# Altium schematic sheet Power.SchDoc
size A3; SheetNumber: 3; SheetTotal: 4
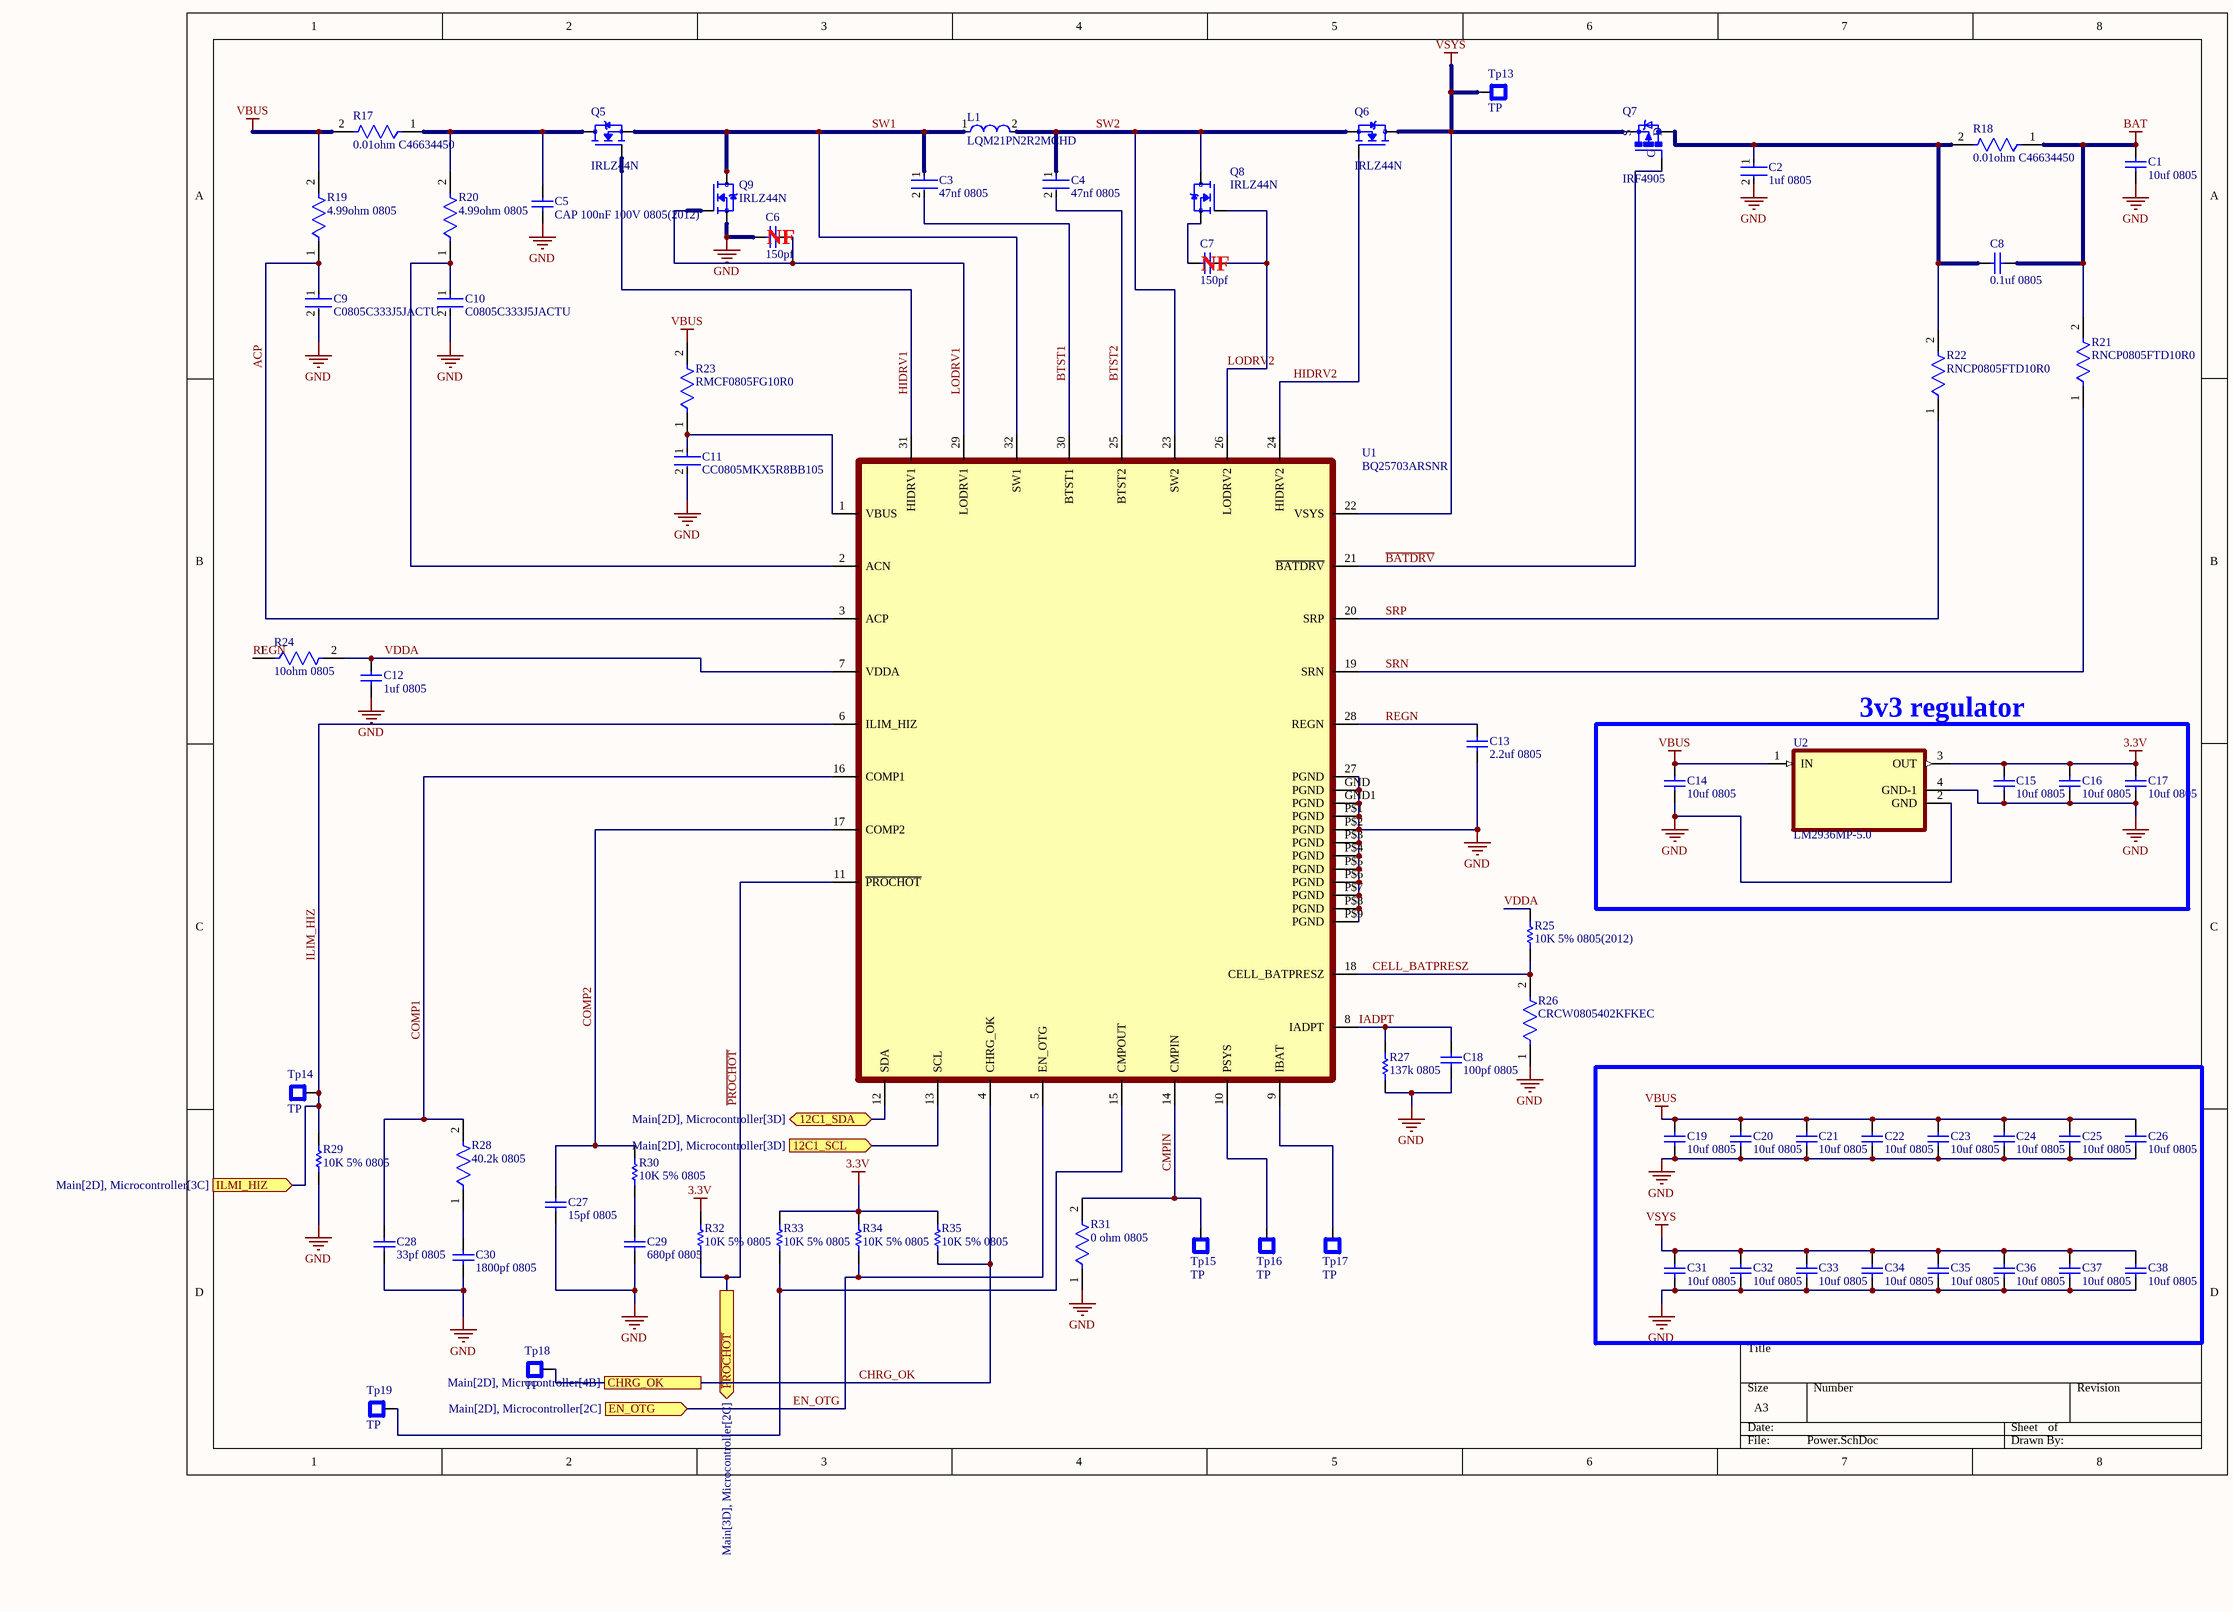
[diagram p0: Power.SchDoc]

## Parts
C1  10uf 0805  [CAPC2013X140X50ML20T25]
C2  1uf 0805  [FP-0805-L_2_01_0_2-W_1_25-MFG]
C3  47nf 0805  [FP-C0805C-DN-MFG]
C4  47nf 0805  [FP-C0805C-DN-MFG]
C5  CAP 100nF 100V 0805(2012)  [CAPC0805(2012)145_M]
C6  150pf  [CAPC2013X145X48NL20T23]
C7  150pf  [CAPC2013X145X48NL20T23]
C8  0.1uf 0805  [CAPC2013X140X50ML20T25]
C9  C0805C333J5JACTU  [FP-C0805C-DN-MFG]
C10  C0805C333J5JACTU  [FP-C0805C-DN-MFG]
C11  CC0805MKX5R8BB105  [FP-CC0805-0_85-MFG]
C12  1uf 0805  [CAPC2013X145X50NL20T20]
C13  2.2uf 0805  [CAPC2013X100X50ML20T25]
C14  10uf 0805  [CAPC2013X140X50ML20T25]
C15  10uf 0805  [CAPC2013X140X50ML20T25]
C16  10uf 0805  [CAPC2013X140X50ML20T25]
C17  10uf 0805  [CAPC2013X140X50ML20T25]
C18  100pf 0805  [CAPC2013X127X50NL20T25]
C19  10uf 0805  [CAPC2013X140X50ML20T25]
C20  10uf 0805  [CAPC2013X140X50ML20T25]
C21  10uf 0805  [CAPC2013X140X50ML20T25]
C22  10uf 0805  [CAPC2013X140X50ML20T25]
C23  10uf 0805  [CAPC2013X140X50ML20T25]
C24  10uf 0805  [CAPC2013X140X50ML20T25]
C25  10uf 0805  [CAPC2013X140X50ML20T25]
C26  10uf 0805  [CAPC2013X140X50ML20T25]
C27  15pf 0805  [CAPC2013X94X50LL20T25]
C28  33pf 0805  [CAPC2013X145X48LL20T23]
C29  680pf 0805  [CAPC0805(2012)145_L]
C30  1800pf 0805  [CAPC2013X145X48ML20T23]
C31  10uf 0805  [CAPC2013X140X50ML20T25]
C32  10uf 0805  [CAPC2013X140X50ML20T25]
C33  10uf 0805  [CAPC2013X140X50ML20T25]
C34  10uf 0805  [CAPC2013X140X50ML20T25]
C35  10uf 0805  [CAPC2013X140X50ML20T25]
C36  10uf 0805  [CAPC2013X140X50ML20T25]
C37  10uf 0805  [CAPC2013X140X50ML20T25]
C38  10uf 0805  [CAPC2013X140X50ML20T25]
L1  LQM21PN2R2MCHD  [FP-LQM21PN_CH-IPC_C]
Q5  IRLZ44N  [TO254P1054X469X1930-3]
Q6  IRLZ44N  [TO254P1054X469X1930-3]
Q7  IRF4905  [TO220BH]
Q8  IRLZ44N  [TO254P1054X469X1930-3]
Q9  IRLZ44N  [TO254P1054X469X1930-3]
R17  0.01ohm C46634450  [FP-CRCW0805-HPe3-MFG]
R18  0.01ohm C46634450  [FP-CRCW0805-HPe3-MFG]
R19  4.99ohm 0805  [FP-CRCW0805-HPe3-MFG]
R20  4.99ohm 0805  [FP-CRCW0805-HPe3-MFG]
R21  RNCP0805FTD10R0  [FP-RNCP0805-IPC_C]
R22  RNCP0805FTD10R0  [FP-RNCP0805-IPC_C]
R23  RMCF0805FG10R0  [FP-RMCF0805-IPC_B]
R24  10ohm 0805  [FP-RMCF0805-IPC_B]
R25  10K 5% 0805(2012)  [RESC0805(2012)_L]
R26  CRCW0805402KFKEC  [FP-CRCW0805-e3-IPC_B]
R27  137k 0805  [RESC2013X60X35ML10T20]
R28  40.2k 0805  [FP-ESR10-MFG]
R29  10K 5% 0805  [RESC0805(2012)_L]
R30  10K 5% 0805  [RESC0805(2012)_L]
R31  0 ohm 0805  [FP-HCJ0805-MFG]
R32  10K 5% 0805  [RESC0805(2012)_L]
R33  10K 5% 0805  [RESC0805(2012)_L]
R34  10K 5% 0805  [RESC0805(2012)_L]
R35  10K 5% 0805  [RESC0805(2012)_L]
Tp13  TP  [Tp]
Tp14  TP  [Tp]
Tp15  TP  [Tp]
Tp16  TP  [Tp]
Tp17  TP  [Tp]
Tp18  TP  [Tp]
Tp19  TP  [Tp]
U1  BQ25703ARSNR  [BQ25703A_QFN-32]
U2  LM2936MP-5.0  [SOT230P700X180-4N]

## Blocks framed on the sheet
3v3 regulator: C14-C17 U2

## Ports
12C1_SCL (in, see Main[2D], Microcontroller[3D]), 12C1_SDA (bidir, see Main[2D], Microcontroller[3D]), CHRG_OK (see Main[2D], Microcontroller[4B]), EN_OTG (in, see Main[2D], Microcontroller[2C]), ILMI_HIZ (in, see Main[2D], Microcontroller[3C]), ~{PROCHOT} (out, see Main[3D], Microcontroller[2C])

## Nets
3.3V: C15.2 C16.2 C17.2 R32.2 R33.2 R34.2 R35.2 U2.3(OUT)
BAT: C1.2 C8.1 R18.1 R21.2
GND: C1.1 C2.2 C5.1 C6.1 C9.2 C10.2 C11.2 C12.1 C13.1 C14.1 C15.1 C16.1 C17.1 C18.1 C19.1 C20.1 C21.1 C22.1 C23.1 C24.1 C25.1 C26.1 C27.1 C28.1 C29.1 C30.1 C31.1 C32.1 C33.1 C34.1 C35.1 C36.1 C37.1 C38.1 Q9.3(S) R26.1 R27.1 R29.1 R31.1 U1.27(PGND) U1.GND(PGND) U1.GND1(PGND) U1.P$1(PGND) U1.P$2(PGND) U1.P$3(PGND) U1.P$4(PGND) U1.P$5(PGND) U1.P$6(PGND) U1.P$7(PGND) U1.P$8(PGND) U1.P$9(PGND) U2.2(GND) U2.4(GND-1)
VBUS: C14.2 C19.2 C20.2 C21.2 C22.2 C23.2 C24.2 C25.2 C26.2 R17.2 R19.2 R23.2 U2.1(IN)
VSYS: C31.2 C32.2 C33.2 C34.2 C35.2 C36.2 C37.2 C38.2 Q6.2(D) Q7.S Tp13.1 U1.22(VSYS)
12C1_SCL: U1.13(SCL) ; port 12C1_SCL
12C1_SDA: U1.12(SDA) ; port 12C1_SDA
~{BATDRV}: Q7.G U1.21(~{BATDRV})
~{PROCHOT}: R32.1 U1.11(~{PROCHOT}) ; port ~{PROCHOT}
ACP: C9.1 R19.1 U1.3(ACP)
BTST1: C3.2 U1.30(BTST1)
BTST2: C4.2 U1.25(BTST2)
CELL_BATPRESZ: R25.1 R26.2 U1.18(CELL_BATPRESZ)
CHRG_OK: R35.1 Tp18.1 U1.4(CHRG_OK) ; port CHRG_OK
CMPIN: R31.2 Tp15.1 U1.14(CMPIN)
COMP1: C28.2 R28.2 U1.16(COMP1)
COMP2: C27.2 R30.2 U1.17(COMP2)
EN_OTG: R34.1 U1.5(EN_OTG) ; port EN_OTG
HIDRV1: Q5.1(G) U1.31(HIDRV1)
HIDRV2: Q6.1(G) U1.24(HIDRV2)
IADPT: C18.2 R27.2 U1.8(IADPT)
ILIM_HIZ: R29.2 Tp14.1 U1.6(ILIM_HIZ) ; port ILMI_HIZ
LODRV1: C6.2 Q9.1(G) U1.29(LODRV1)
LODRV2: C7.1 Q8.1(G) U1.26(LODRV2)
REGN: C13.2 R24.1 U1.28(REGN)
SRN: R21.1 U1.19(SRN)
SRP: R22.1 U1.20(SRP)
SW1: C3.1 L1.1 Q5.3(S) Q9.2(D) U1.32(SW1)
SW2: C4.1 L1.2 Q6.3(S) Q8.2(D) U1.23(SW2)
VDDA: C12.2 R24.2 R25.2 U1.7(VDDA)
NetC2_1: C2.1 C8.2 Q7.D R18.2 R22.2
NetC5_2: C5.2 Q5.2(D) R17.1 R20.2
NetC7_2: C7.2 Q8.3(S)
NetC10_1: C10.1 R20.1 U1.2(ACN)
NetC11_1: C11.1 R23.1 U1.1(VBUS)
NetC29_2: C29.2 R30.1
NetC30_2: C30.2 R28.1
NetR33_1: R33.1 Tp19.1 U1.15(CMPOUT)
NetTp16_1: Tp16.1 U1.10(PSYS)
NetTp17_1: Tp17.1 U1.9(IBAT)

## Notes on the sheet
- (near C6) NF
- (near C7) NF

## Library data of the parts
C1 C14-C17 C19-C26 C31-C38 = CMP-2007-04702-1: Manufacturer: AVX Interconnect / Elco; Part Number: 0805ZC106KAT2A
C2 = CMP-07738-122049624-1: 08051C105K4T2A Cap Ceramic 1uF 100V X7R 10% Pad SMD 0805 125C Automotive T/R; Capacitance: 1µF; Tolerance: 10%; Dielectric: X7R; Case/Package: 0805; Material: Ceramic; Height: 1.4mm; Voltage Rating (DC): 100V; Voltage Rating: 100V; Schedule B: 8532240020; NexarPartId: 122049624; RoHS: Compliant; Lifecycle Status: Production; Min Operating Temperature: -55°C; Max Operating Temperature: 125°C
C3 C4 = CMP-2007-00394-2: CAP CER 0.047UF 50V X7R 0805; Manufacturer: KEMET; Manufacturer Part Number: C0805C473K5RACAUTO; Value: 47,000 pF; Tolerance: 0.1; Temperature Coefficient: 30ppm/°C; Material: Ceramic; Temperature: -55°C to +125°C; ComponentLink2Description: Datasheet; Ipc Land Pattern Name: CAPC200125X78; Automotive: No; Voltage Rating: 50 V; Package: C0805C-DN; Category: Cap; Temperature Range High: +125°C; Device Class L2: Capacitors; Lead Free: Yes; Height: 0.88mm; Temperature Range Low: -55°C; Digikey Description: CAP CER 0.047UF 50V X7R 0805; ComponentLink2URL: https://content.kemet.com/datasheets/KEM_C1003_C0G_SMD.pdf; Device Class L1: Passive Components; Octopart: https://octopart.com/c0805c473k5racauto-kemet-12580596; Device Class L3: Ceramic Capacitors; RoHS: TRUE; Temperature Characteristic: X7R; Mouser Description: Multilayer Ceramic Capacitors MLCC - SMD/SMT 0.047uF 50volts 10% X7R AUTO; Capacitance: 47,000 pF
C5 = CMP-1036-04429-1: CAP 100nF 100V ±10% 0805 (2012 Metric) Thickness 1.45mm SMD; Tolerance: Â±10%; Case-Metric: 2012; Case-EIA: 0805; Rated Voltage: 100 V; Max Thickness: 1.45 mm; Technology: SMT; Value: 100nF
C6 C7 = CMP-2007-01759-1: Part Number: VJ0805A151JXAMC; Manufacturer: Vitramon
C8 = CMP-2007-04651-1: Part Number: 0805DD104KAT2A; Manufacturer: AVX Interconnect / Elco
C9 C10 = CMP-03020-013264-1: CAP CER 0.033UF 50V U2J 0805; Manufacturer: KEMET; Material: Ceramic; Value: 33,000 pF; Temperature Coefficient: 30ppm/°C; Tolerance: 0.05; Temperature Range Low: -55°C; Automotive: No; Device Class L3: Ceramic Capacitors; Device Class L2: Capacitors; RoHS: TRUE; Octopart: https://octopart.com/c0805c333j5jactu-kemet-74774612; Device Class L1: Passive Components; Manufacturer Part Number: C0805C333J5JACTU; ComponentLink2URL: https://content.kemet.com/datasheets/KEM_C1003_C0G_SMD.pdf; Temperature Characteristic: U2J; Ipc Land Pattern Name: CAPC200125X78; Height: 0.88mm; Category: Cap; ComponentLink2Description: Datasheet; Temperature: -55°C to +125°C; Capacitance: 33,000 pF; Package: C0805C-DN; Temperature Range High: +125°C; Voltage Rating: 50 V; Lead Free: Yes; Digikey Description: CAP CER 0.033UF 50V U2J 0805
C11 = CMP-03422-000762-1: CAP CER 1UF 25V X5R 0805; Manufacturer: Yageo; Material: Ceramic; Tolerance: 0.2; Package: CC0805-0.85; Value: 1 uF; Digikey Description: CAP CER 1UF 25V X5R 0805; ComponentLink2URL: http://www.yageo.com/documents/recent/UPY-GPHC_Y5V_6.3V-to-50V_8.pdf; Temperature: -30°C to +85°C; Device Class L1: Passive Components; Lead Free: Yes; Automotive: No; Ipc Land Pattern Name: CAPC200125X85; Footprint Url: http://www.yageo.com/exep/pages/download/literatures/UPY-C_GEN_24.pdf; Device Class L3: Ceramic Capacitors; RoHS: TRUE; Temperature Range High: +85°C; Capacitance: 1 uF; Height: 0.95mm; Mouser Description: Cap Cer 1uf 25v X5r 0805; Temperature Range Low: -30°C; Octopart: https://octopart.com/cc0805mkx5r8bb105-yageo-81932645; Voltage Rating: 25 V; ComponentLink2Description: Datasheet; Device Class L2: Capacitors; Temperature Characteristic: X5R; Manufacturer Part Number: CC0805MKX5R8BB105; Category: Cap
C12 = CMP-2007-01676-1: Part Number: VJ0805Y105KXQRW1BC; Manufacturer: Vitramon
C13 = CMP-2007-03688-1: Part Number: C0805C225M4PACTU; Manufacturer: Kemet
C18 = CMP-2007-04832-1: Part Number: 08052C101KAT2A; Manufacturer: AVX Interconnect / Elco
C27 = CMP-2007-04132-1: Part Number: 08051A150KAT2A; Manufacturer: AVX Interconnect / Elco
C28 = CMP-2007-01784-1: Part Number: VJ0805A330JXBAC; Manufacturer: Vitramon
C29 = CMP-1036-02840-1: CAP 680pF 100V ±10% 0805 (2012 Metric) Thickness 1.45mm SMD; Tolerance: Â±10%; Case-Metric: 2012; Case-EIA: 0805; Max Thickness: 1.45 mm; Technology: SMT; Value: 680pF; Rated Voltage: 100 V
C30 = CMP-2007-01890-1: Part Number: VJ0805A182FXAMT; Manufacturer: Vitramon
L1 = CMP-06042-016495-1: Multilayer Type Inductor for Power Lines, 2012, 2.2μH, 20%, 0.25Ω, 1.3A; RoHS Compliant: Yes
Q5 Q6 Q8 Q9 = IRLZ44N: N-Channel 55 V 47A (Tc) 3.8W (Ta), 110W (Tc) Surface Mount D2PAK; MF: Infineon / IR; Package: TO-220-3 Infineon / IR; Availability: Not in stock; Value: *; MP: IRLZ44N; Check_prices: https://www.snapeda.com/parts/IRLZ44N/Infineon/view-part/?ref=eda; Price: None; SnapEDA_Link: https://www.snapeda.com/parts/IRLZ44N/Infineon/view-part/?ref=snap
Q7 = IRF4905: P-Channel 55 V 74A (Tc) 200W (Tc) Through Hole TO-220AB; MF: Infineon / IR; SnapEDA_Link: https://www.snapeda.com/parts/IRF4905/Infineon/view-part/?ref=snap; Package: TO-263-3 Infineon / IR; Value: *; MP: IRF4905; Check_prices: https://www.snapeda.com/parts/IRF4905/Infineon/view-part/?ref=eda
R17-R20 = CMP-02407-002418-1: RES Thick Film, 4.99Ω, 0.5%, 0.5W, 100ppm/°C, 0805
R21 R22 = CMP-26527-001729-1: 10Ω ±1% 0.25W 0805 High Power Anti-Sulfur Thin Film Chip Resistor; Temperature Coefficient: 100ppm/°C; Max Power Dissipation: 250mW; Resistance: 10R; Length: 0.079inch; Tolerance: 1%; Series: RNCP; Case Code (Metric): 2012; Packaging: Tape and Reel; Resistor Type: Thin Film; Mount: Surface Mount; Min Operating Temperature: -55°C; Case Code (Imperial): 0805; Height: 0.024inch; Features: Moisture Resistant; RoHS Compliant: Yes; Width: 0.049inch; Max Operating Temperature: 155°C; Case/Package: 0805; Number of Terminations: 2
R23 R24 = CMP-26527-004108-1: 10Ω ±1% 0.125W 0805 Thick Film Chip Resistor AEC-Q200 compliant; Max Power Dissipation: 125mW; Resistance: 10R; Temperature Coefficient: 100ppm/°C; Series: RMCF; Resistor Type: Thick Film; Width: 0.049inch; Contact Plating: Tin; Number of Terminations: 2; Radiation Hardening: No; Max Operating Temperature: 155°C; Length: 0.079inch; RoHS Compliant: Yes; Mount: Surface Mount; Tolerance: 1%; Case/Package: 0805; Packaging: Tape and Reel; Min Operating Temperature: -55°C; Height: 0.026inch; Features: Automotive AEC-Q200
R25 R29 R30 R32-R35 = CMP-1013-00098-1: 10K 0.125W 5% 0805 (2012 Metric)  SMD; Case-EIA: 0805; Case-Metric: 2012; Value: 10000.00 Ohm; Power: 0.125 W; Technology: SMT; Tolerance: 5 %
R26 = CMP-02407-010674-1: RES Thick Film, 402kΩ, 1%, 0.125W, 100ppm/°C, 0805; Resistance: 402kR; Max Power Dissipation: 125mW; Temperature Coefficient: 100ppm/°C; Composition: Thick Film; Height: 0.02inch; Length: 0.079inch; Package Quantity: 20000; Tolerance: 1%; Max Operating Temperature: 155°C; Lead Free: Lead Free; Min Operating Temperature: -55°C; Number of Terminations: 2; Case/Package: 0805; Packaging: Tape and Reel; Width: 0.049inch; Features: Automotive AEC-Q200
R27 = CMP-2001-00916-1: Manufacturer: Yageo; Part Number: RC0805FR-07137KL
R28 = CMP-08839-028060-1: 40.2kΩ ±1% 0.4W 0805 Anti-Surge Chip Resistor AEC-Q200; Max Power Dissipation: 400mW; Resistance: 40.2kR; Temperature Coefficient: 100ppm/°C; Length: 0.079inch; Width: 0.049inch; Package Quantity: 5000; Min Operating Temperature: -55°C; Case/Package: 0805; Features: Automotive AEC-Q200; Series: ESR10; Height: 0.026inch; Packaging: Tape and Reel; Max Operating Temperature: 155°C; Tolerance: 1%; RoHS Compliant: Yes; Number of Terminations: 2; Resistor Type: Thick Film
R31 = CMP-26527-000104-1: RES 0 OHM JUMPER 1/2W 0805; Resistance: 0mR; Radiation Hardening: No; Case Code (Imperial): 0805; Number of Terminations: 2; Lead Free: Lead Free; Max Operating Temperature: 155°C; Width: 0.049inch; Case Code (Metric): 2012; Height: 0.026inch; Mount: Surface Mount; Min Operating Temperature: -55°C; Packaging: Tape and Reel; Package Quantity: 1; Termination: Wraparound; Length: 0.079inch; RoHS Compliant: Yes; Case/Package: 0805
U1 = BQ25703ARSNR: MCU 32-bit ARM Cortex M0+ RISC 128KB Flash 1.8V/2.5V/3.3V 48-Pin LQFP Tray; Manufacturer: STMicroelectronics; Manufacturer Part Number: STM32G071CBT6; MF: Texas Instruments; ADC Channels (Resolution): 14-Ch 12-Bit; Core Architecture: ARM Cortex-M0+; DAC Channels (Resolution): 2-Ch 12-Bit; Data Bus Width: 32b; EEPROM Memory Size: 0B; Frequency: 64MHz; Interface: I2S; Clock Frequency: 48MHz; Max Junction Temperature (Tj): 105°C; Max Supply Current: 7mA; Max Supply Voltage: 3.6V; Min Supply Voltage: 1.7V; Number of A/D Converters: 1; Number of ADC Channels: 17; Number of Channels: 14; Number of D/A Converters: 2; Number of I/Os: 5; Number of Interrupts: 44; Number of Timers/Counters: 12; Number of UART Channels: 0; Number of USART Channels: 4; Operating Supply Voltage: 1.8V; Peripherals: POR, PWM, WDT; RAM Size: 36kB; SnapEDA_Link: https://www.snapeda.com/parts/BQ25703ARSNR/Texas+Instruments/view-part/?ref=snap; Package: WQFN-32 Texas Instruments; Value: *; MP: BQ25703ARSNR; Check_prices: https://www.snapeda.com/parts/BQ25703ARSNR/Texas+Instruments/view-part/?ref=eda; Supplier: Avnet; Supplier Part Number: 84AC2899; RoHS: Compliant; Category: Microcontrollers; Stock: 1757; Pricing: 1=3.97, 10=3.29, 25=3.08, 50=2.97, 100=2.86, 250=2.76, 500=2.69 (USD); Ambient Temperature Range High: 85°C; Case/Package: LFQFP; China RoHS: Compliant; Country of Origin: Mainland China; Export Control Classification Number (ECCN) Code: 3A991.A.2; Flash Memory Size: 128kB; Height: 1.6mm; Height - Seated (Max): 1.6mm; Harmonized Tariff Schedule (HTS) Code: 8542.31.00.25; Introduction Date: 2019-03-07; Length: 7mm; Lifecycle Status: Production; Max Operating Temperature: 85°C; Memory Size: 128kB; Memory Format: FLASH; Min Operating Temperature: -40°C; Number of I2C Channels: 2; Number of SPI Channels: 2; Number of Terminals: 48; Number of USB Channels: 2; REACH SVHC: Yes; Schedule B: 8542310000, 8542310000|8542310000, 8542310000|8542310000|8542310000|8542310000|8542310000; Terminal Pitch: 500µm; Width: 7mm; ComponentLink1URL: https://datasheet.octopart.com:443/STM32G071CBT6-STMicroelectronics-datasheet-159144893.pdf?src-supplier=IHS; ComponentLink1Description: https://datasheet.octopart.com:443/STM32G071CBT6-STMicroelectronics-datasheet-159144893.pdf?src-supplier=IHS; ComponentLink2URL: https://datasheet.octopart.com:443/STM32G071CBT6-STMicroelectronics-datasheet-132344621.pdf?src-supplier=ODG+(Origin+Data+Global); ComponentLink2Description: https://datasheet.octopart.com:443/STM32G071CBT6-STMicroelectronics-datasheet-132344621.pdf?src-supplier=ODG+(Origin+Data+Global); ComponentLink3URL: https://datasheet.octopart.com:443/STM32G071CBT6-STMicroelectronics-datasheet-130125765.pdf?src-supplier=element14+APAC; ComponentLink3Description: https://datasheet.octopart.com:443/STM32G071CBT6-STMicroelectronics-datasheet-130125765.pdf?src-supplier=element14+APAC
U2 = LM2936MP-5.0: 50-mA, 60-V, low-IQ, low-dropout voltage regulator with reverse voltage protection 4-SOT-223 -40 to 125; MF: Texas Instruments; SnapEDA_Link: https://www.snapeda.com/parts/LM2936MP-5.0/Texas+Instruments/view-part/?ref=snap; Package: SOT-223-4 Texas Instruments; Value: *; MP: LM2936MP-5.0; Check_prices: https://www.snapeda.com/parts/LM2936MP-5.0/Texas+Instruments/view-part/?ref=eda